# EAGLE design MeasureComponents (EAGLE 9.3.0)
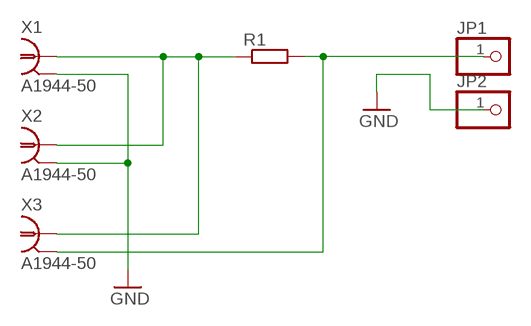
[diagram p0: schematic, sheet 1]

## Parts
JP1  PINHD-1X1  [1X01]
JP2  PINHD-1X1  [1X01]
R1  R-EU_M1206  [M1206]
X1  A1944-50  [A1944]
X2  A1944-50  [A1944]
X3  A1944-50  [A1944]

## Nets
GND: JP2.1 X1.2 X1.3 X1.4 X1.5 X2.2 X2.3 X2.4 X2.5
N$1: R1.1 X1.1 X2.1 X3.1
N$3: JP1.1 R1.2 X3.2 X3.3 X3.4 X3.5

## Library data of the parts
JP1 JP2 = pinhead:PINHD-1X1: PIN HEADER
R1 = rcl:R-EU_: RESISTOR, European symbol
X1-X3 = con-coax:A1944-50: BNC CONNECTOR 50 Ohm distributor Buerklin 78F2475; OC_FARNELL: unknown; OC_NEWARK: unknown

## Board
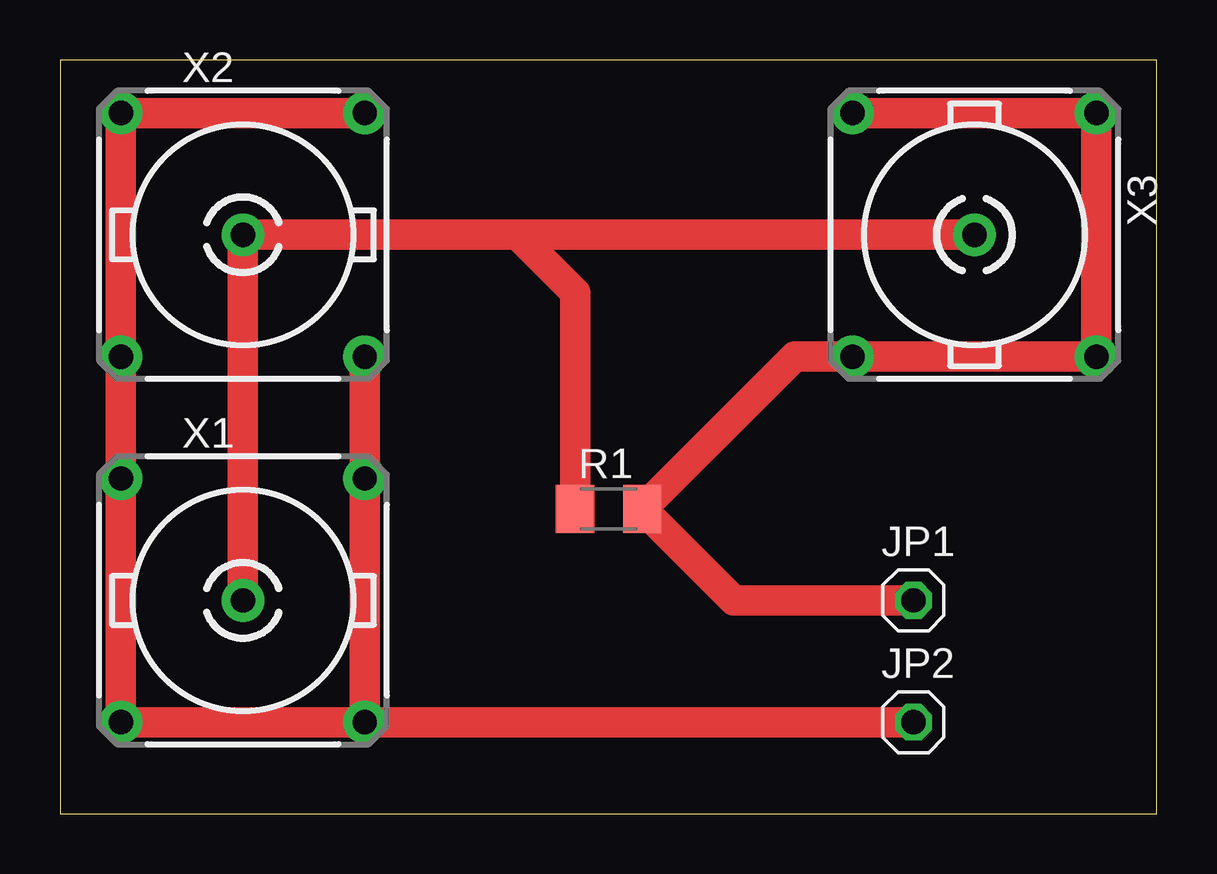
[diagram p1: board, top side]

Size 45.7 x 31.42 mm. Coordinates in mm from the lower left corner, seen from the top.
Outline: 0,0 45.7,0 45.7,31.42 0,31.42 0,0
Copper layers (1*16): Top 0.035mm / dielectric 1.5mm / Bottom 0.035mm
Design rules "default": minimum track width 6mil, minimum drill 0.35mm, track to track 6mil, track to pad 6mil, pad to pad 6mil, via to via 6mil, smd to smd 6mil, copper to edge 40mil, drill to drill 6mil, minimum pad ring 10mil, minimum via ring 8mil, stop-mask expansion 4mil, vias tented up to drill 0mil, thermal gap 10mil

### Footprints (pad centres in the part's own frame; a part is rotated, then mirrored left to right if it is on the bottom)
1X01 = drill 1.016 octagon: 1 0,0
M1206 = smd 1.6 x 2: 1 -1.4,0; 2 1.4,0
A1944 = drill 1.016 pad 1.778: 1 0,0; 2 5.08,5.08; 3 -5.08,5.08; 4 -5.08,-5.08; 5 5.08,-5.08

### Placement (x,y rotation side)
JP1  35.56,8.89 0 top
JP2  35.56,3.81 0 top
R1  22.86,12.7 0 top
X1  7.62,8.89 0 top
X2  7.62,24.13 0 top
X3  38.1,24.13 270 top

### Tracks (layer width: path | path; a pad name or v marks a point on that pad's centre or on a via)
GND
  Top 1.27: X2.2 X2.3 X2.4 X1.3 X1.4 X1.5 | X1.5 X1.2 X2.5 | JP2.1 X1.5
N$1
  Top 1.27: X1.1 X2.1 19.05,24.13 | X3.1 19.05,24.13 | R1.1 21.46,21.72 19.05,24.13
N$3
  Top 1.27: X3.4 X3.3 X3.2 X3.5 30.61,19.05 R1.2 28.07,8.89 JP1.1